# EAGLE schematic WAirU_v1.1 (EAGLE 9.4.0)
COMPANY: ADAFRUIT INDUSTRIES; DRAWN: KTOWN; REV: B

## Sheet 1 of 2
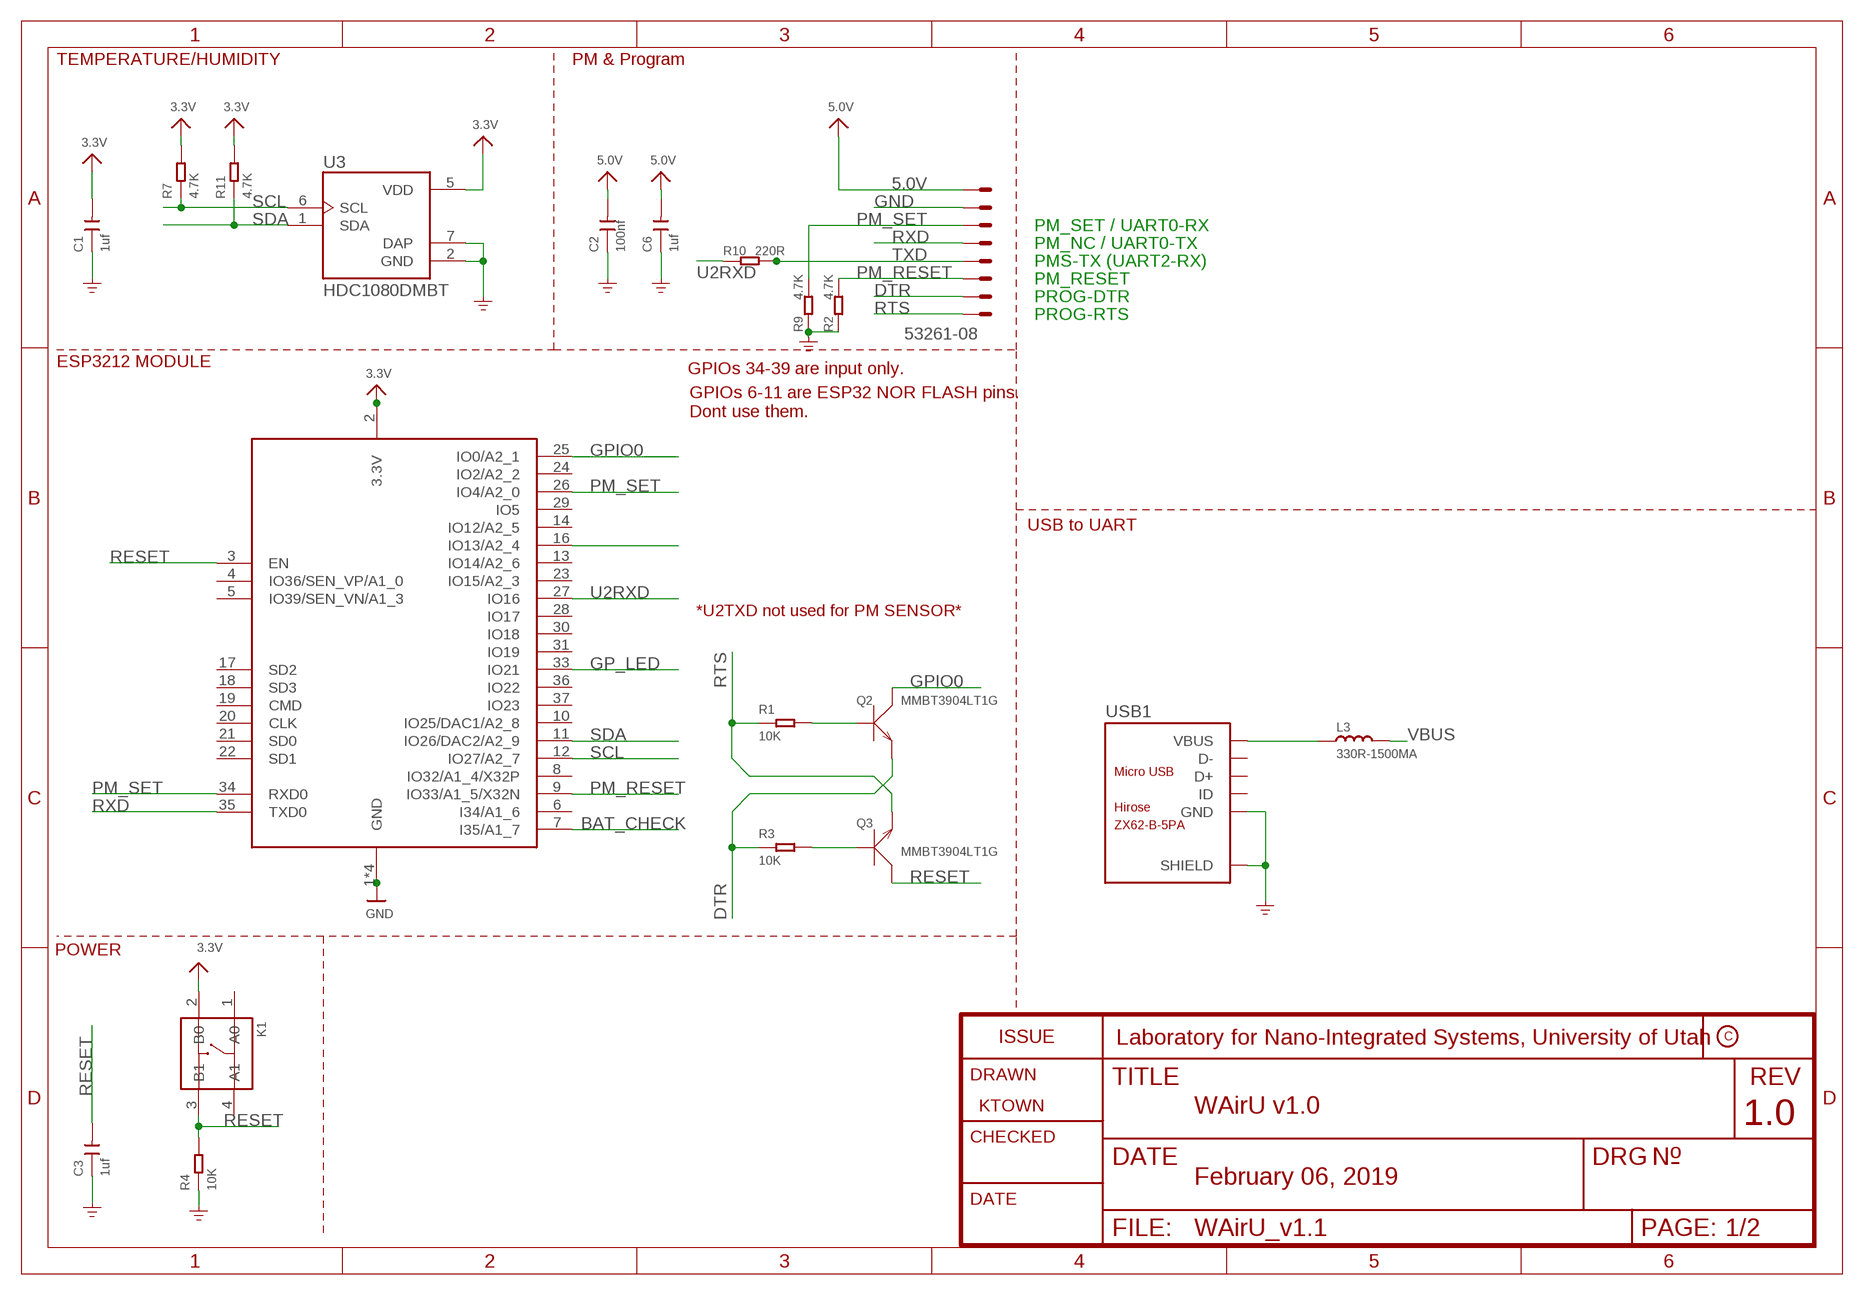
[diagram p0: schematic, sheet 1]
FRAME1 (FRAME_A4): COMPANY: TETRAD: SENSOR NETWORK SOLUTIONS, LLC; REV: 1.0

### Parts
C1  1uf  CERAMIC-1UF-25V-10%-X7R(0603)  [C0603]
C2  100nf  CERAMIC-100NF-50V-10%-X7R(0603)  [C0603]
C3  1uf  CERAMIC-1UF-25V-10%-X7R(0603)  [C0603]
C6  1uf  CERAMIC-1UF-25V-10%-X7R(0603)  [C0603]
K1  SMD-SWITCH-TACTILE-SPST-NO(4P-D6.0MM)  [SW4-SMD-6.0X6.0X5.0MM]
L3  330R-1500MA  SMD-FERRITE-BEAD-330R-1500MA(0805)'0805'  [L0805]
MOLEX-53261-0871  53261-08  [53261-08]
Q2  MMBT3904LT1G  SMD-TRANSISTORS-NPN-40V-200MA-MMBT3904LT1G(SOT-23)  [SOT-23]
Q3  MMBT3904LT1G  SMD-TRANSISTORS-NPN-40V-200MA-MMBT3904LT1G(SOT-23)  [SOT-23]
R1  10K  SMD-RES-10K-1%-1/10W(0603)  [R0603]
R2  4.7K  SMD-RES-220R-5%-1/10W(0603)  [R0603]
R3  10K  SMD-RES-10K-1%-1/10W(0603)  [R0603]
R4  10K  SMD-RES-10K-1%-1/10W(0603)  [R0603]
R7  4.7K  SMD-RES-4.7K-5%-1/10W(0603)  [R0603]
R9  4.7K  SMD-RES-220R-5%-1/10W(0603)  [R0603]
R10  220R  SMD-RES-220R-5%-1/10W(0603)  [R0603]
R11  4.7K  SMD-RES-4.7K-5%-1/10W(0603)  [R0603]
U3  HDC1080DMBT  [SON100P300X300X80-7N]
U7  ESP32_WROOM32_SKINNY  [WROOM32_SKINNY]
USB1  ZX62-B-5PA  MICRO-USB-SMD(ZX62-B-5PA)  [MICRO-USB5+6P-SMD-0.65-AB]

### Nets
3.3V: C1.2 K1.2(B0) R7.2 R11.2 U3.5(VDD) U7.2(3.3V) ; also sheet 2
5.0V: C2.2 C6.2 MOLEX-53261-0871.8 ; also sheet 2
BAT_CHECK: U7.7(I35/A1_7) ; also sheet 2
DTR: MOLEX-53261-0871.2 Q2.2(E) R3.1
GND: C1.1 C2.1 C3.1 C6.1 MOLEX-53261-0871.7 R2.1 R4.1 R9.1 U3.2(GND) U3.7(DAP) U7.1(GND) U7.15(GND) U7.38(GND) U7.P$1(GND) USB1.5(GND) USB1.P1(SHIELD) USB1.P2(SHIELD) USB1.P3_1(SHIELD) USB1.P3_2(SHIELD) USB1.P3_3(SHIELD) USB1.P4_1(SHIELD) USB1.P4_2(SHIELD) USB1.P4_3(SHIELD) USB1.P5(SHIELD) USB1.P6(SHIELD) ; supply symbol labelled GND_POWER ; also sheet 2
GP_LED: U7.33(IO21) ; also sheet 2
GPIO0: Q2.3(C) U7.25(IO0/A2_1)
N$7: U7.16(IO13/A2_4)
N$12: Q3.1(B) R3.2
N$13: Q2.1(B) R1.2
PM_RESET: MOLEX-53261-0871.3 R2.2 U7.9(IO33/A1_5/X32N)
PM_SET: MOLEX-53261-0871.6 R9.2 U7.26(IO4/A2_0) U7.34(RXD0)
RESET: C3.2 K1.3(B1) Q3.3(C) R4.2 U7.3(EN)
RTS: MOLEX-53261-0871.1 Q3.2(E) R1.1
RXD: MOLEX-53261-0871.5 U7.35(TXD0)
SCL: R7.1 U3.6(SCL) U7.12(IO27/A2_7)
SDA: R11.1 U3.1(SDA) U7.11(IO26/DAC2/A2_9)
TXD: MOLEX-53261-0871.4 R10.2
U2RXD: R10.1 U7.27(IO16)
VBUS: L3.2 ; also sheet 2
VBUS_RAW: L3.1 USB1.1(VBUS)
Unconnected: K1.1(A0) K1.4(A1) U7.4(IO36/SEN_VP/A1_0) U7.5(IO39/SEN_VN/A1_3) U7.6(I34/A1_6) U7.8(IO32/A1_4/X32P) U7.10(IO25/DAC1/A2_8) U7.13(IO14/A2_6) U7.14(IO12/A2_5) U7.17(SD2) U7.18(SD3) U7.19(CMD) U7.20(CLK) U7.21(SD0) U7.22(SD1) U7.23(IO15/A2_3) U7.24(IO2/A2_2) U7.28(IO17) U7.29(IO5) U7.30(IO18) U7.31(IO19) U7.36(IO22) U7.37(IO23) USB1.2(D-) USB1.3(D+) USB1.4(ID)

### Notes on the sheet
- TEMPERATURE/HUMIDITY | PM & Program
- PM_SET / UART0-RX
- PM_NC / UART0-TX
- PMS-TX (UART2-RX)
- PM_RESET
- PROG-DTR
- PROG-RTS
- ESP3212 MODULE
- GPIOs 34-39 are input only.
- GPIOs 6-11 are ESP32 NOR FLASH pins.
  Dont use them.
- USB to UART
- *U2TXD not used for PM SENSOR*
- POWER
- Laboratory for Nano-Integrated Systems, University of Utah
- WAirU v1.0
- February 06, 2019

## Sheet 2 of 2
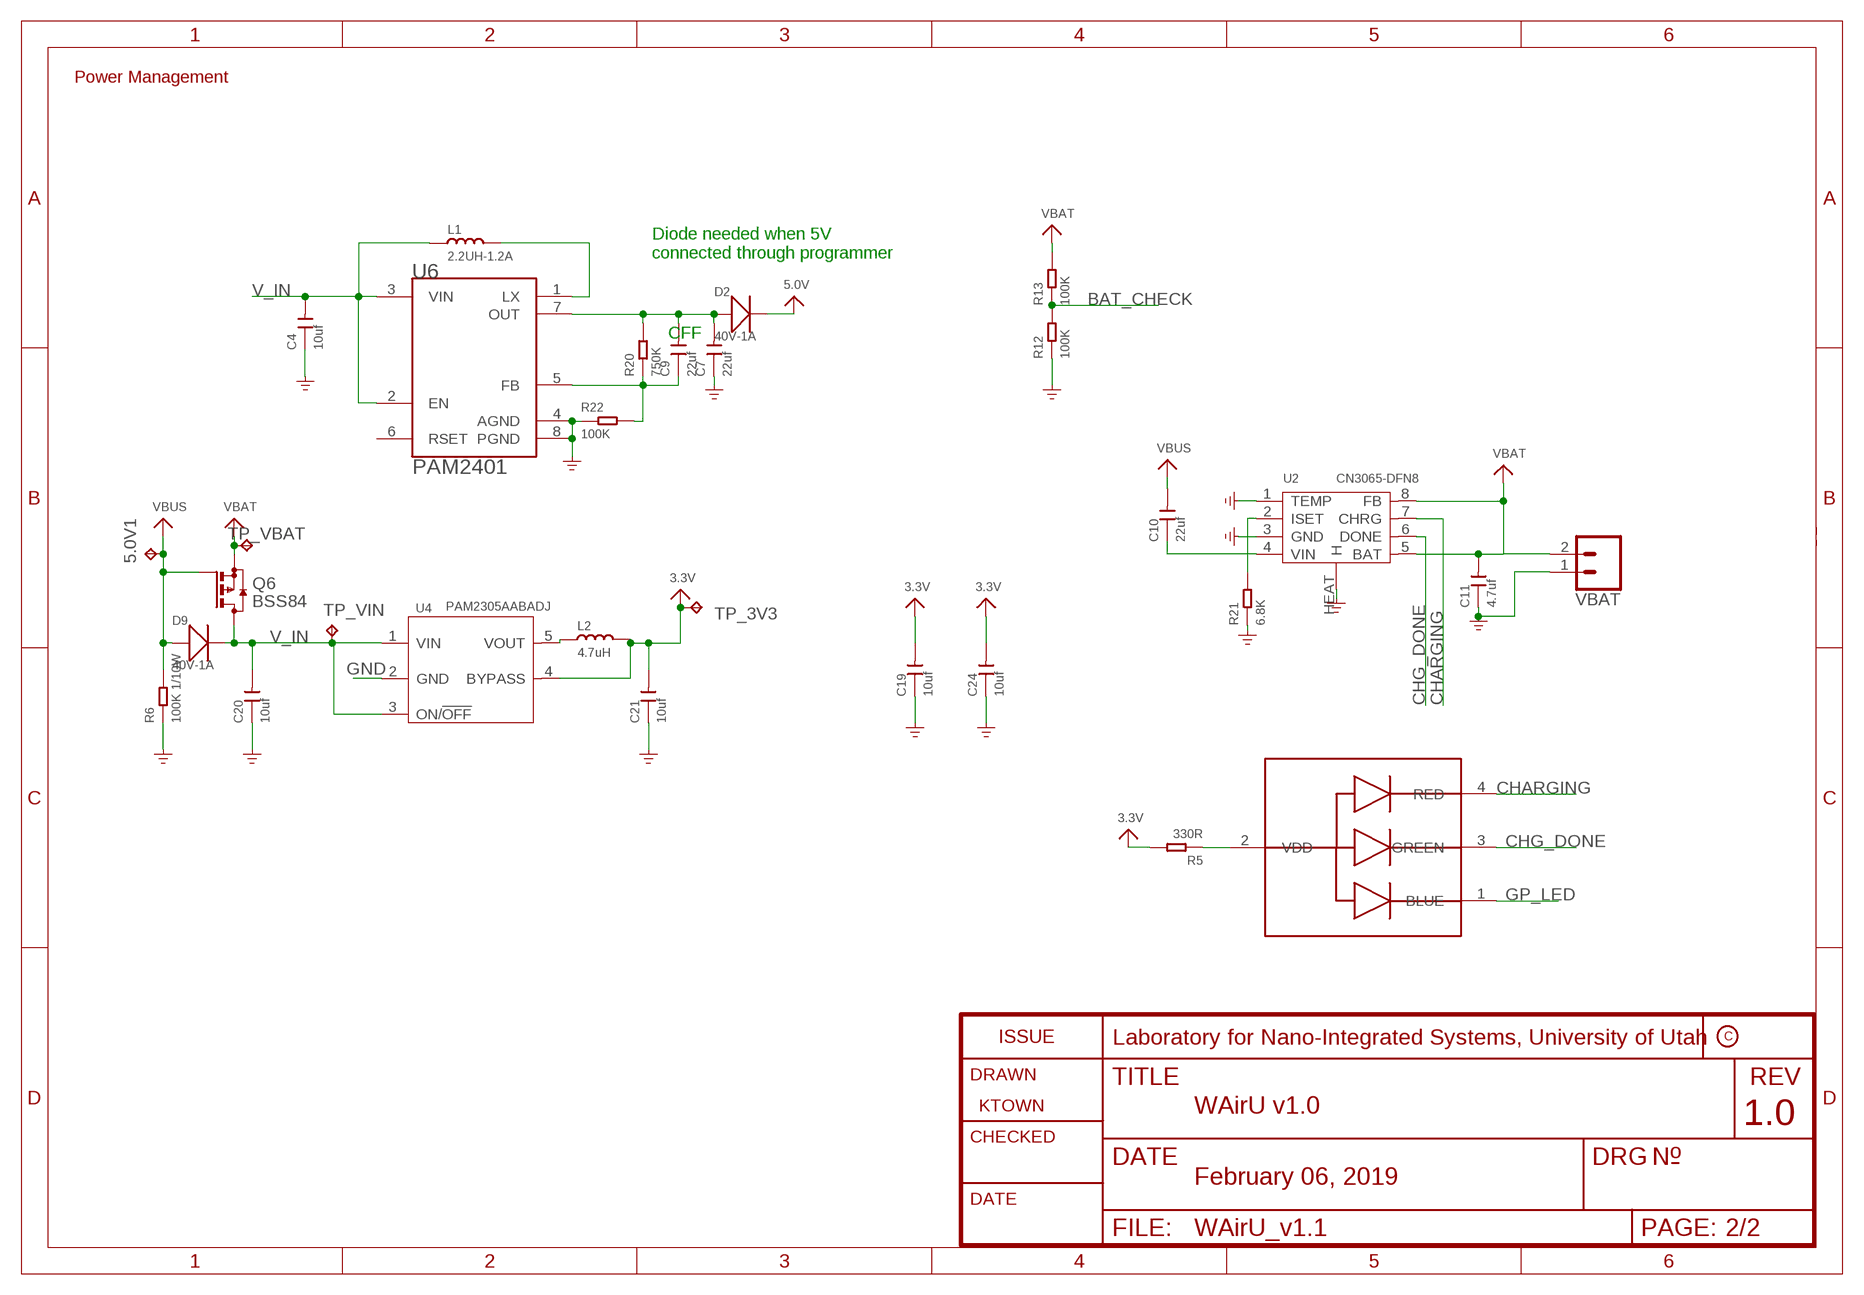
[diagram p1: schematic, sheet 2]
FRAME2 (FRAME_A4): COMPANY: TETRAD: SENSOR NETWORK SOLUTIONS, LLC; REV: 1.0
FRAME3 (FRAME_A4): COMPANY: TETRAD: SENSOR NETWORK SOLUTIONS, LLC; REV: 1.0

### Parts
5.0V1  TPTP20SQ  [TP20SQ]
C4  10uf  CERAMIC-10UF-10V-10%-X5R(0603)  [C0603]
C7  22uf  CERAMIC-10UF-10V-10%-X5R(0603)  [C0603]
C9  22uf  CERAMIC-10UF-10V-10%-X5R(0603)  [C0603]
C10  22uf  CERAMIC-10UF-10V-10%-X5R(0603)  [C0603]
C11  4.7uf  CERAMIC-4.7UF-10V-10%-X5R(0603)  [C0603]
C19  10uf  CERAMIC-10UF-10V-10%-X5R(0603)  [C0603]
C20  10uf  CERAMIC-10UF-10V-10%-X5R(0603)  [C0603]
C21  10uf  CERAMIC-10UF-10V-10%-X5R(0603)  [C0603]
C24  10uf  CERAMIC-10UF-10V-10%-X5R(0603)  [C0603]
D2  40V-1A  SMD-DIODE-SCHOTTKY-40V-1A(DO-214AC)  [DO-214AC]
D9  40V-1A  SMD-DIODE-SCHOTTKY-40V-1A(DO-214AC)  [DO-214AC]
L1  2.2UH-1.2A  SMD-INDUCTOR-2.2UH-20%-1.2A(0805)  [L0805]
L2  4.7uH  SMD-INDUCTOR-10UH-20%-2.35A(2P-5X5X4MM)  [L5040S]
Q6  BSS84  [SOT23]
R5  330R  SMD-RES-330R-1%-1/10W(0603)  [R0603]
R6  100K 1/10W  SMD-RES-100K-5%-1/10W(0603)  [R0603]
R12  100K  SMD-RES-100K-5%-1/10W(0603)  [R0603]
R13  100K  SMD-RES-100K-5%-1/10W(0603)  [R0603]
R20  750K  SMD-RES-100K-5%-1/10W(0603)  [R0603]
R21  6.8K  SMD-RES-6.8K-1%-1/10W(0603)  [R0603]
R22  100K  SMD-RES-100K-5%-1/10W(0603)  [R0603]
TP_3V3  TPTP20SQ  [TP20SQ]
TP_VBAT  TPTP20SQ  [TP20SQ]
TP_VIN  TPTP20SQ  [TP20SQ]
U2  CN3065-DFN8  PMIC-CN3065(DFN8)  [DFN8G-0.5-3X3MM]
U4  PAM2305AABADJ  PMIC-LP2985-33DBVR(SOT23-5)  [SOT-23-5]
U6  PAM2401  [MSOP-8]
U$4  19-237A/BHR6GHC-M01/2T  [SMD-19-237A]
VBAT  CONN_02-JST-2MM-SMT  [JST-2-SMD]

### Nets
3.3V: C19.2 C21.2 C24.2 L2.2 R5.2 TP_3V3.TP U4.4(BYPASS) ; also sheet 1
5.0V: D2.2(-) ; also sheet 1
BAT_CHECK: R12.2 R13.1 ; also sheet 1
CHARGING: U2.7(CHRG) U$4.4(RED)
CHG_DONE: U2.6(DONE) U$4.3(GREEN)
GND: C4.1 C7.1 C11.1 C19.1 C20.1 C21.1 C24.1 R6.1 R12.1 R21.1 R22.1 U2.1(TEMP) U2.3(GND) U2.HEAT(H) U4.2(GND) U6.4(AGND) U6.8(PGND) VBAT.1 ; supply symbol labelled GND_POWER ; also sheet 1
GP_LED: U$4.1(BLUE) ; also sheet 1
N$3: L1.2 U6.1(LX)
N$4: C7.2 C9.2 D2.1(+) R20.2 U6.7(OUT)
N$5: C10.1 U2.4(VIN)
N$6: R21.2 U2.2(ISET)
N$8: L2.1 U4.5(VOUT)
N$9: R5.1 U$4.2(VDD)
N$10: C9.1 R20.1 R22.2 U6.5(FB)
V_IN: C4.2 C20.2 D9.2(-) L1.1 Q6.3(D) TP_VIN.TP U4.1(VIN) U4.3(ON/!OFF) U6.2(EN) U6.3(VIN)
VBAT: C11.2 Q6.2(S) R13.2 TP_VBAT.TP U2.5(BAT) U2.8(FB) VBAT.2
VBUS: 5.0V1.TP C10.2 D9.1(+) Q6.1(G) R6.2 ; also sheet 1
Unconnected: U6.6(RSET)

### Notes on the sheet
- Power Management
- Diode needed when 5V 
  connected through programmer
- CFF
- Laboratory for Nano-Integrated Systems, University of Utah
- WAirU v1.0
- February 06, 2019

## Library data of the parts
5.0V1 TP_3V3 TP_VBAT TP_VIN = testpad:TP: Test pad
C1 C3 C6 = Seeed-Capacitor:CERAMIC-1UF-25V-10%-X7R(0603): 302010139; MPN: CC0603KRX7R8BB105
C2 = Seeed-Capacitor:CERAMIC-100NF-50V-10%-X7R(0603): 302010138; MPN: CC0603KRX7R9BB104
C4 C19-C21 C24 = Seeed-Capacitor:CERAMIC-10UF-10V-10%-X5R(0603): 302010103; MPN: CC0603KRX5R6BB106
C7 C9 C10 = OPL_Capacitor:CERAMIC-10UF-10V-10%-X5R(0603): 302010103; MPN: CC0603KRX5R6BB106; VALUE: 10uf
C11 = OPL_Capacitor:CERAMIC-4.7UF-10V-10%-X5R(0603): 302010111; MPN: CC0603KRX5R6BB475
D2 D9 = Seeed-Diode:SMD-DIODE-SCHOTTKY-40V-1A(DO-214AC): 304020027; MPN: 1N5819
K1 = OPL_Switch:SMD-SWITCH-TACTILE-SPST-NO(4P-D6.0MM): 311020004; MPN: DTSM-62K-S-V-T/R(SN431)
L1 = OPL_Inductor:SMD-INDUCTOR-2.2UH-20%-1.2A(0805): 303010086; MPN: LQM2MPN2R2MG0
L2 = OPL_Inductor:SMD-INDUCTOR-10UH-20%-2.35A(2P-5X5X4MM): 303010147
L3 = Seeed-Inductor:SMD-FERRITE-BEAD-330R-1500MA(0805): 303030006; MPN: BLM21PG331SN1D
MOLEX-53261-0871 = con-molex:53?-08: CONNECTOR wire to board 1.25 mm (.049 inch) pitch header; MF: MOLEX; OC_FARNELL: 1125376; OC_NEWARK: unknown
Q2 Q3 = Seeed-Transistor:SMD-TRANSISTORS-NPN-40V-200MA-MMBT3904LT1G(SOT-23): 305010013; MPN: MMBT3904LT1G
Q6 = BSS84:BSS84: P-CHANNEL MOS FET; AVAILABILITY: Unavailable; DESCRIPTION: P-Channel Enhancement Mode Field Effect Transistor; MF: MICROSS/On Semiconductor; MP: BSS84; PACKAGE: SOT-23 ON Semiconductor; PRICE: None
R1 R3 R4 = Seeed-Resistor:SMD-RES-10K-1%-1/10W(0603): 301010299; MPN: RC0603FR-0710KL
R2 R9 = Seeed-Resistor:SMD-RES-220R-5%-1/10W(0603): 301010163; MPN: RC0603JR-07220RL; VALUE: 220R
R5 = Seeed-Resistor:SMD-RES-330R-1%-1/10W(0603): 301010300; MPN: RC0603FR-07330RL
R6 = Seeed-Resistor:SMD-RES-100K-5%-1/10W(0603): 301010089; MPN: RC0603JR-07100KL
R7 R11 = Seeed-Resistor:SMD-RES-4.7K-5%-1/10W(0603): 301010290; MPN: RC0603JR-074K7L
R10 = Seeed-Resistor:SMD-RES-220R-5%-1/10W(0603): 301010163; MPN: RC0603JR-07220RL
R12 R13 R20 R22 = OPL_Resistor:SMD-RES-100K-5%-1/10W(0603): 301011975; MPN: RC0603JR-07100KL; VALUE: 100K 1/10W
R21 = Seeed-Resistor:SMD-RES-6.8K-1%-1/10W(0603): 301010198; MPN: RC0805JR-07220KL
U2 = Seeed-IC:PMIC-CN3065(DFN8): 310030101; MPN: CN3065
U3 = HDC1080DMBT_TITempHum:HDC1080DMBT: HDC1080 Low Power, High Accuracy Digital Humidity Sensor with Temperature Sensor 6-WSON -40 to 125; DESCRIPTION: HDC1080 Low Power, High Accuracy Digital Humidity Sensor with Temperature Sensor 6-WSON -40 to 125; DIGI-KEY_PART_NUMBER: 296-43864-1-ND; DIGI-KEY_PURCHASE_URL: https://www.digikey.com/product-detail/en/texas-instruments/HDC1080DMBT/296-43864-1-ND/5878615?utm_source=snapeda&utm_medium=aggregator&utm_campaign=symbol; MF: Texas Instruments; MP: HDC1080DMBT; PACKAGE: WDFN-6 Texas Instruments
U4 = OPL_IC:PMIC-LP2985-33DBVR(SOT23-5): 310030033; MPN: LP2985-33DBVR; VALUE: LP2985-33DBVR
U6 = PAM2401_dcdcConverter:PAM2401
U7 = microbuilder:ESP32_WROOM32
U$4 = SS_OPL_Unmade:19-237A/BHR6GHC-M01/2T
USB1 = Seeed-Connector:MICRO-USB-SMD(ZX62-B-5PA): 320010005; MPN: ZX62-B-5PA
VBAT = SparkFun-Connectors:CONN_02: Multi connection point. Often used as Generic Header-pin footprint for 0.1 inch spaced/style header connections On any of the 0.1 inch spaced packages, you can populate with these: Break Away Headers - Straight <https://www.sparkfun.com/products/116> (PRT-00116) Break Away Male Headers - Right Angle <https://www.sparkfun.com/products/553> (PRT-00553) Female Headers <https://www.sparkfun.com/products/115> (PRT-00115) Break Away Headers - Machine Pin <https://www.sparkfun.com/products/117> (PRT-00117) Break Away Female Headers - Swiss Machine Pin <https://www.sparkfun.com/products/743> (PRT-00743) For SCREWTERMINALS and SPRING TERMINALS visit here: Screw Terimnals on SparkFun.com <https://www.sparkfun.com/search/results?term=Screw+Terminals> (5mm/3.5mm/2.54mm spacing) This device is also useful as a general connection point to wire up your design to another part of your project. Our various solder wires solder well into these plated through hole pads. Hook-Up Wire - Assortment (Stranded, 22 AWG) <https://www.sparkfun.com/products/11375> (PRT-11375) Hook-Up Wire - Assortment (Solid Core, 22 AWG) <https://www.sparkfun.com/products/11367> (PRT-11367) View the entire wire category on our website here <https://www.sparkfun.com/categories/141> Special notes: Molex polarized connector foot print use with: PRT-08233 with associated crimp pins and housings. 2.54_SCREWTERM for use with PRT-10571. 3.5mm Screw Terminal footprints for PRT-08084 5mm Screw Terminal footprints for use with PRT-08432; PROD_ID: CONN-11443